# Altium schematic sheet struct.SchDoc
size 594 x 420 mm; CompanyName: БГУИР, 750701; SheetNumber: 2; SheetTotal: 2; Разраб.: Миронь; Пров.: Шемаров
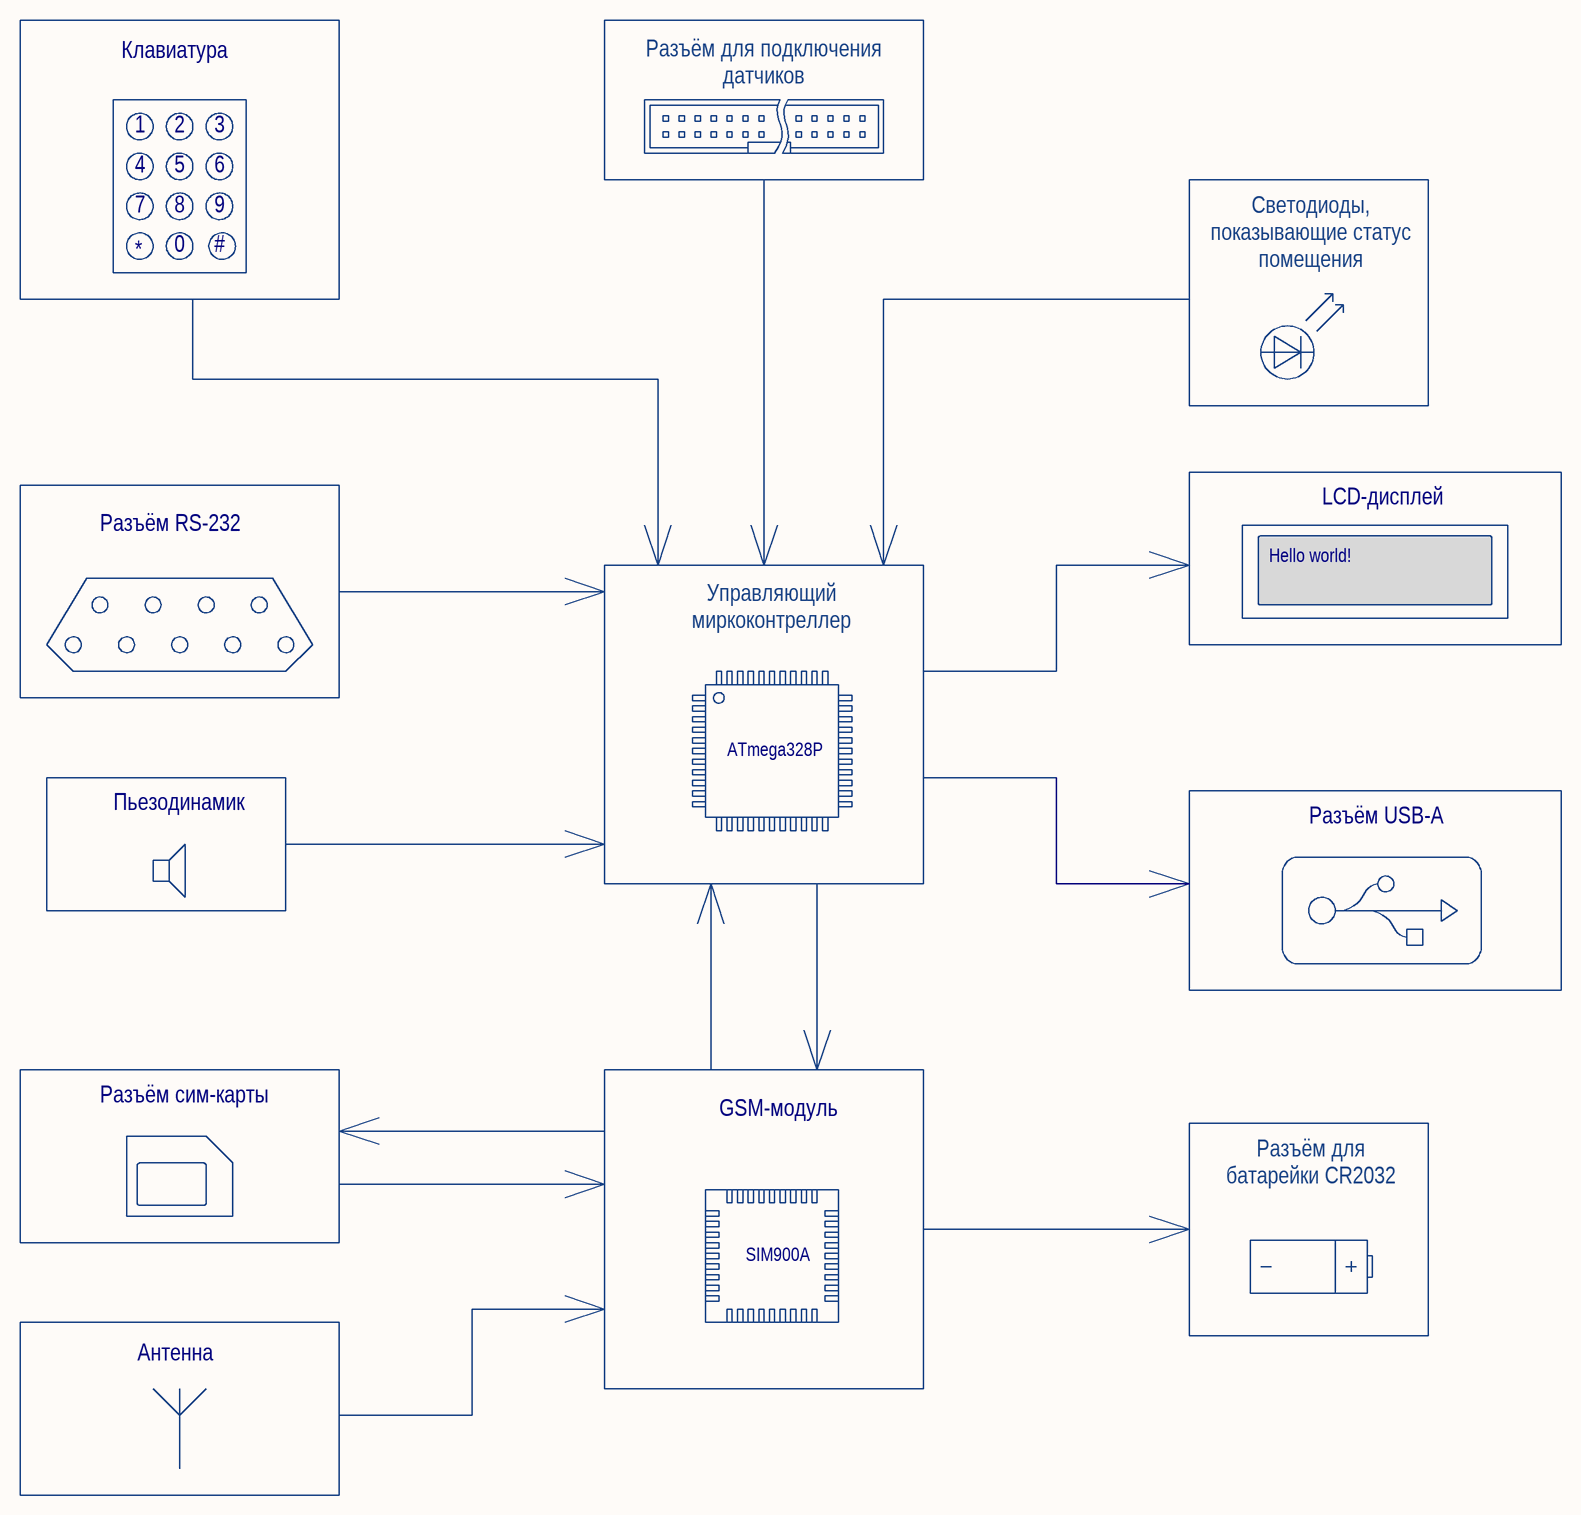
[diagram p0: struct.SchDoc]

## Notes on the sheet
- Клавиатура
- Разъём для подключения датчиков
- 1
- 4
- 5
- 2
- 3
- 6
- *
- 7
- 8
- 0
- #
- 9
- Светодиоды, показывающие статус помещения
- LCD-дисплей
- Разъём RS-232
- Hello world!
- Управляющий миркоконтреллер
- ATmega328P
- Пьезодинамик
- Разъём USB-A
- Разъём сим-карты
- GSM-модуль
- Разъём для батарейки CR2032
- SIM900A
- Антенна
- Перв. примен.
- Справ. №
- Подп. и дата
- Инв. № дубл.
- Взам. инв. №
- Разраб.
- Изм.
- Лист
- № докум.
- Подп.
- Дата
- Лит.
- Масса
- Масштаб
- Пров.
- Т.контр.
- Листов
- Инв. № подл.
- Утв.
- Н.контр.
- Копировал
- Формат А2